# EAGLE schematic H2 V5.3.schh - Copy (EAGLE 9.6.2)

## Sheet 1 of 3
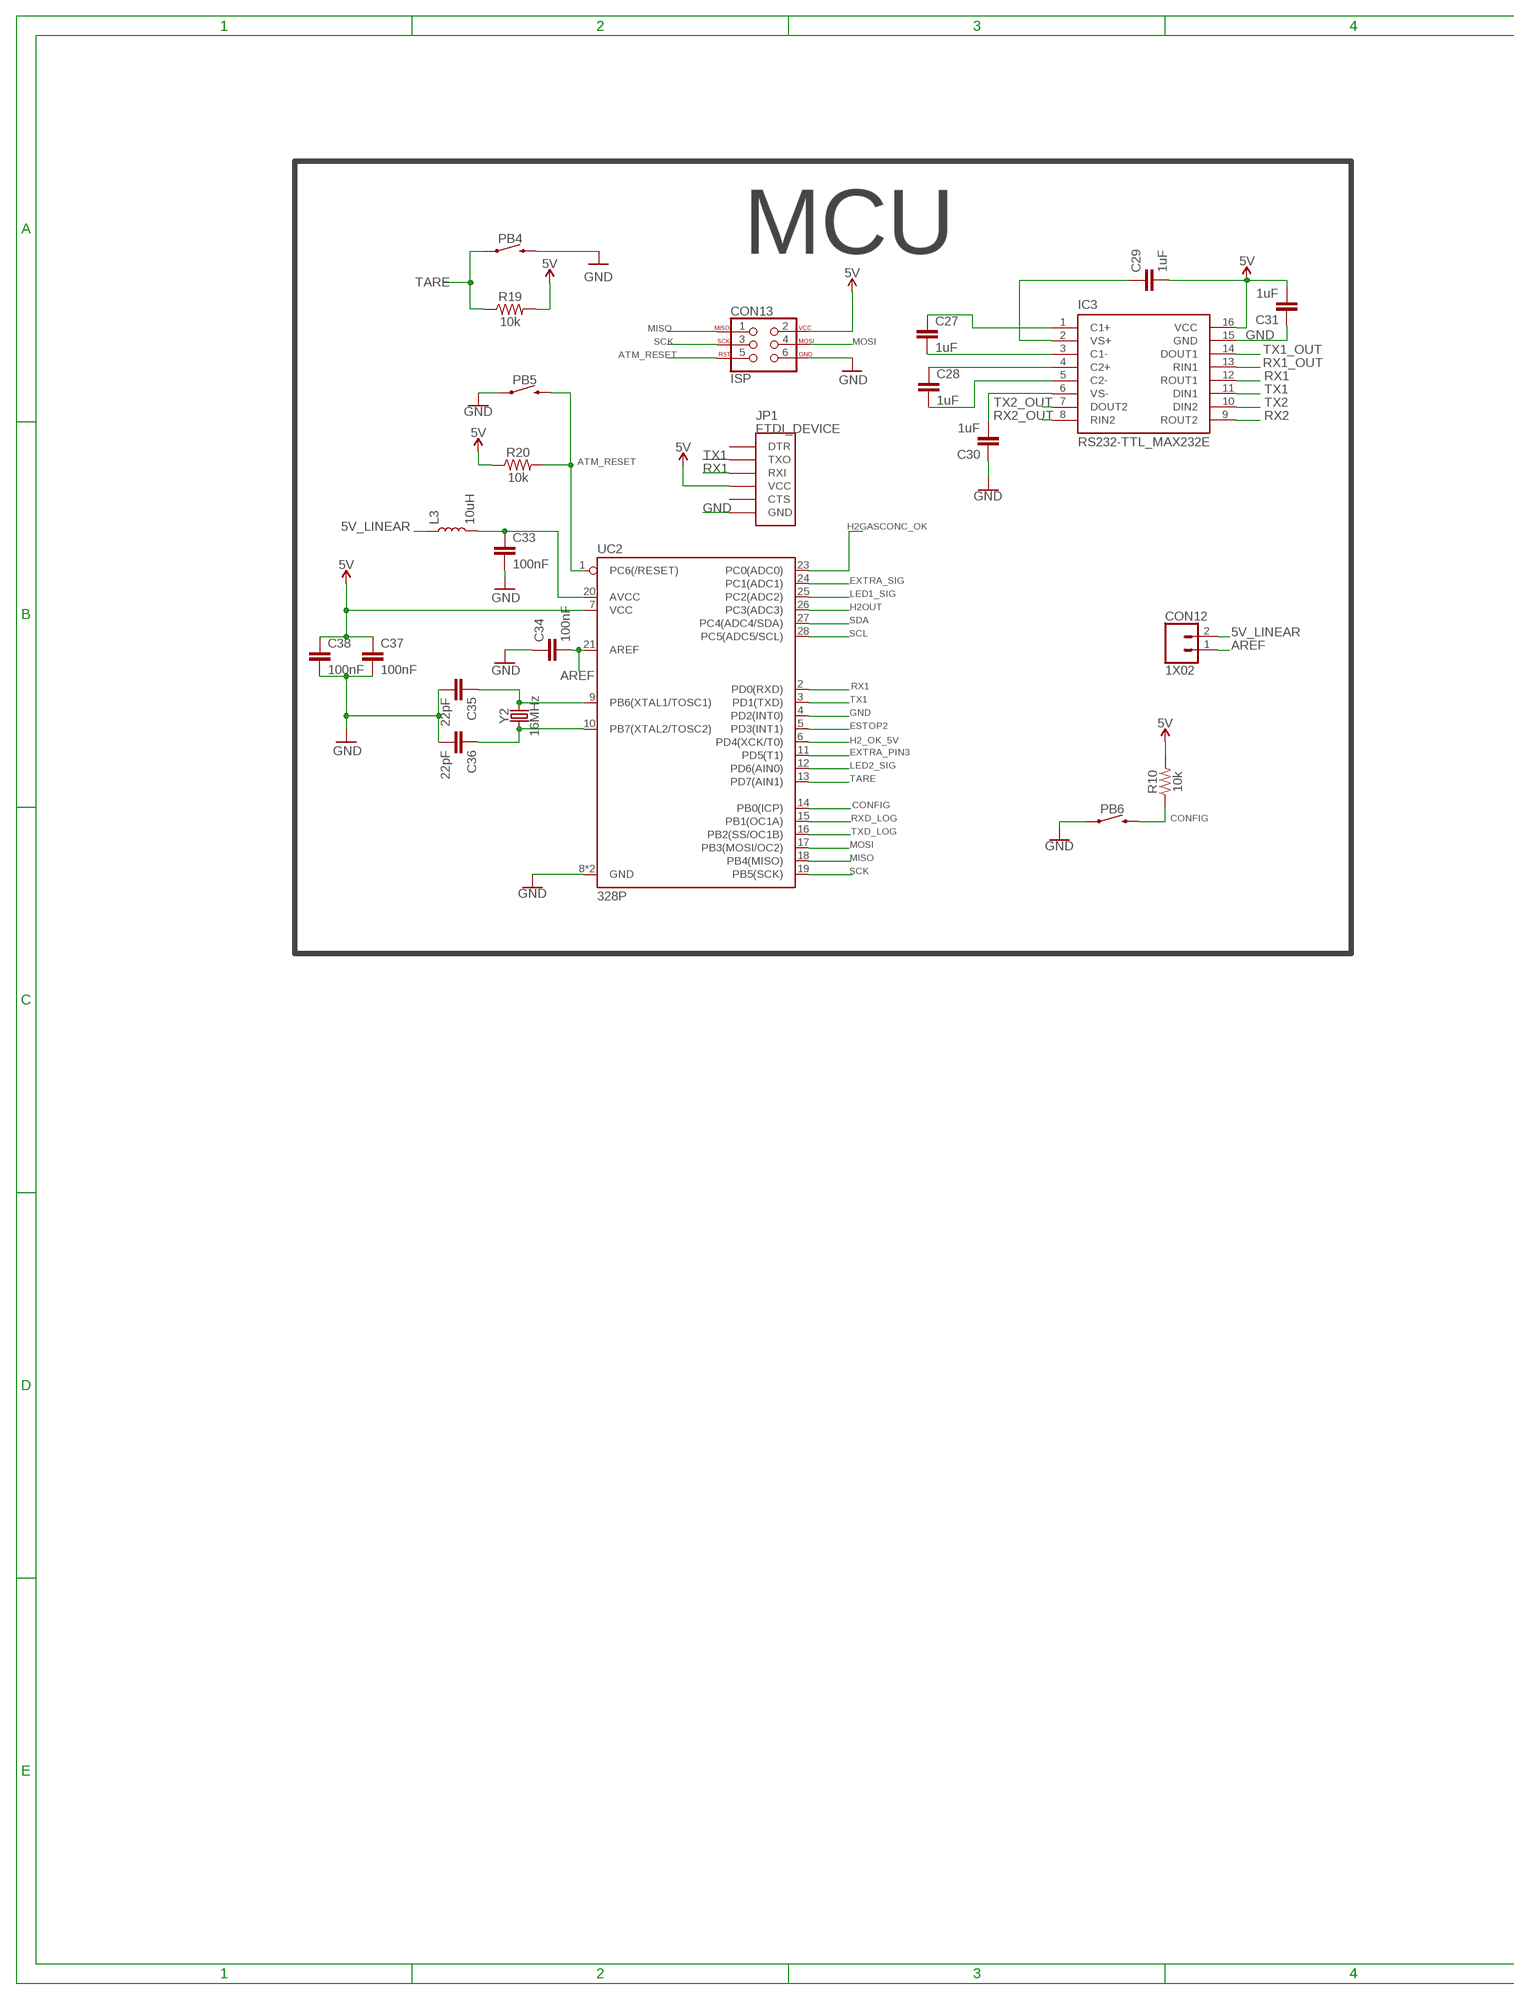
[diagram p0: schematic, sheet 1, part 1 of 2]
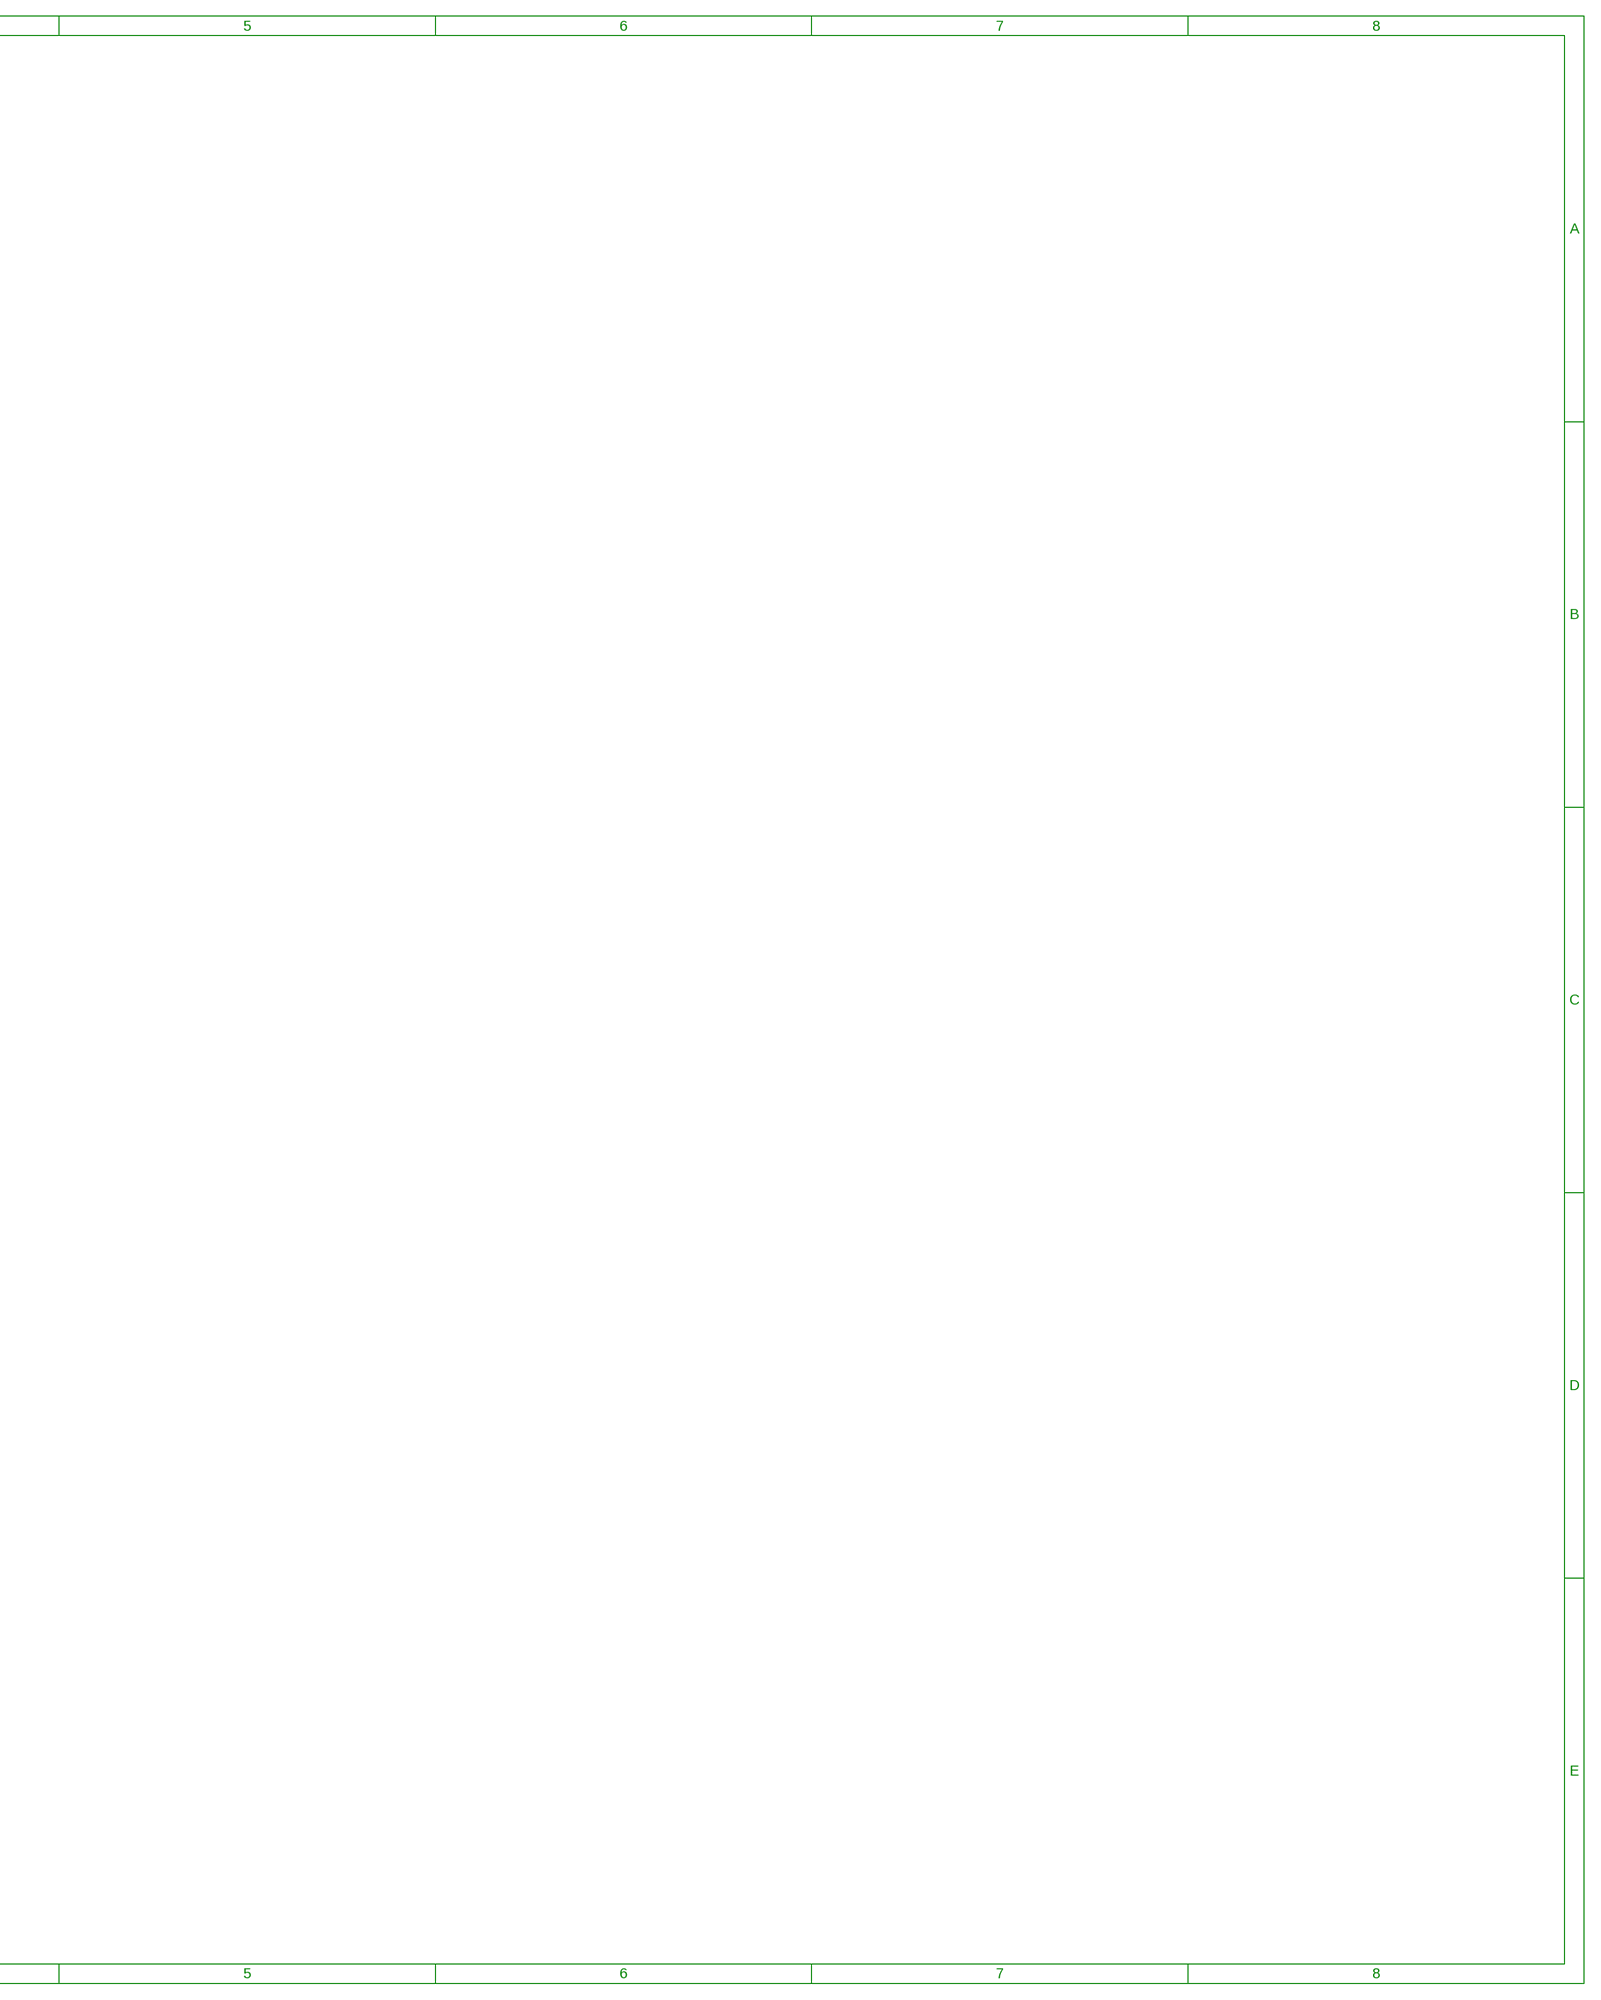
[diagram p1: schematic, sheet 1, part 2 of 2]

### Parts
C27  1uF  CAPACITOR_0805  [0805]
C28  1uF  CAPACITOR_0805  [0805]
C29  1uF  CAPACITOR_0805  [0805]
C30  1uF  CAPACITOR_0805  [0805]
C31  1uF  CAPACITOR_0805  [0805]
C33  100nF  CAPACITOR_0805  [0805]
C34  100nF  CAPACITOR_0805  [0805]
C35  22pF  CAPACITOR_0805  [0805]
C36  22pF  CAPACITOR_0805  [0805]
C37  100nF  CAPACITOR_0805  [0805]
C38  100nF  CAPACITOR_0805  [0805]
CON12  1X02  [1X02]
CON13  ISP  [ISP_CONNECTOR]
IC3  RS232-TTL_MAX232E  [DIP16]
JP1  FTDI_DEVICE  [FTDI_DEVICE_SIDE]
L3  10uH  INDUCTOR_0805  [0805]
PB4  PUSHBUTTON  [PUSHBUTTON]
PB5  PUSHBUTTON  [PUSHBUTTON]
PB6  PUSHBUTTON  [PUSHBUTTON]
R10  10k  RESISTOR_0805  [0805]
R19  10k  RESISTOR_0805  [0805]
R20  10k  RESISTOR_0805  [0805]
UC2  328P  ATMEGA328P_DIP28  [DIP28]
Y2  16MHz  CRYSTAL-16MHZPTH-HC49US  [HC49US]

### Nets
5V: C29.2 C31.2 C37.1 C38.1 CON13.2 IC3.16(VCC) JP1.P$4(VCC) R10.2 R19.2 R20.1 UC2.7(VCC) ; also sheet 2,3
5V_LINEAR: CON12.2 L3.1 ; also sheet 2,3
AREF: C34.2 CON12.1 UC2.21(AREF)
ATM_RESET: CON13.5 PB5.3 PB5.4 R20.2 UC2.1(PC6(/RESET))
CONFIG: PB6.3 PB6.4 R10.1 UC2.14(PB0(ICP))
ESTOP2: UC2.5(PD3(INT1))
EXTRA_PIN3: UC2.11(PD5(T1))
EXTRA_SIG: UC2.24(PC1(ADC1)) ; also sheet 3
GND: C30.1 C31.1 C33.2 C34.1 C35.2 C36.2 C37.2 C38.2 CON13.6 IC3.15(GND) JP1.P$6(GND) PB4.3 PB4.4 PB5.1 PB5.2 PB6.1 PB6.2 UC2.4(PD2(INT0)) UC2.8(GND) UC2.22(GND) ; also sheet 2,3
H2_OK_5V: UC2.6(PD4(XCK/T0)) ; also sheet 3
H2GASCONC_OK: UC2.23(PC0(ADC0)) ; also sheet 3
H2OUT: UC2.26(PC3(ADC3)) ; also sheet 2
LED1_SIG: UC2.25(PC2(ADC2)) ; also sheet 2
LED2_SIG: UC2.12(PD6(AIN0)) ; also sheet 2
MISO: CON13.1 UC2.18(PB4(MISO))
MOSI: CON13.4 UC2.17(PB3(MOSI/OC2))
N$14: C35.1 UC2.9(PB6(XTAL1/TOSC1)) Y2.2
N$17: C36.1 UC2.10(PB7(XTAL2/TOSC2)) Y2.1
N$19: C33.1 L3.2 UC2.20(AVCC)
N$24: C27.2 IC3.3(C1-)
N$26: C27.1 IC3.1(C1+)
N$27: C28.1 IC3.4(C2+)
N$28: C28.2 IC3.5(C2-)
N$29: C30.2 IC3.6(VS-)
N$30: C29.1 IC3.2(VS+)
RX1: IC3.12(ROUT1) JP1.P$3(RXI) UC2.2(PD0(RXD))
RX1_OUT: IC3.13(RIN1) ; also sheet 3
RX2: IC3.9(ROUT2)
RX2_OUT: IC3.8(RIN2)
RXD_LOG: UC2.15(PB1(OC1A)) ; also sheet 2
SCK: CON13.3 UC2.19(PB5(SCK))
SCL: UC2.28(PC5(ADC5/SCL)) ; also sheet 2
SDA: UC2.27(PC4(ADC4/SDA)) ; also sheet 2
TARE: PB4.1 PB4.2 R19.1 UC2.13(PD7(AIN1))
TX1: IC3.11(DIN1) JP1.P$2(TXO) UC2.3(PD1(TXD))
TX1_OUT: IC3.14(DOUT1) ; also sheet 3
TX2: IC3.10(DIN2)
TX2_OUT: IC3.7(DOUT2)
TXD_LOG: UC2.16(PB2(SS/OC1B)) ; also sheet 2
Unconnected: JP1.P$1(DTR) JP1.P$5(CTS)

### Notes on the sheet
- MCU

## Sheet 2 of 3
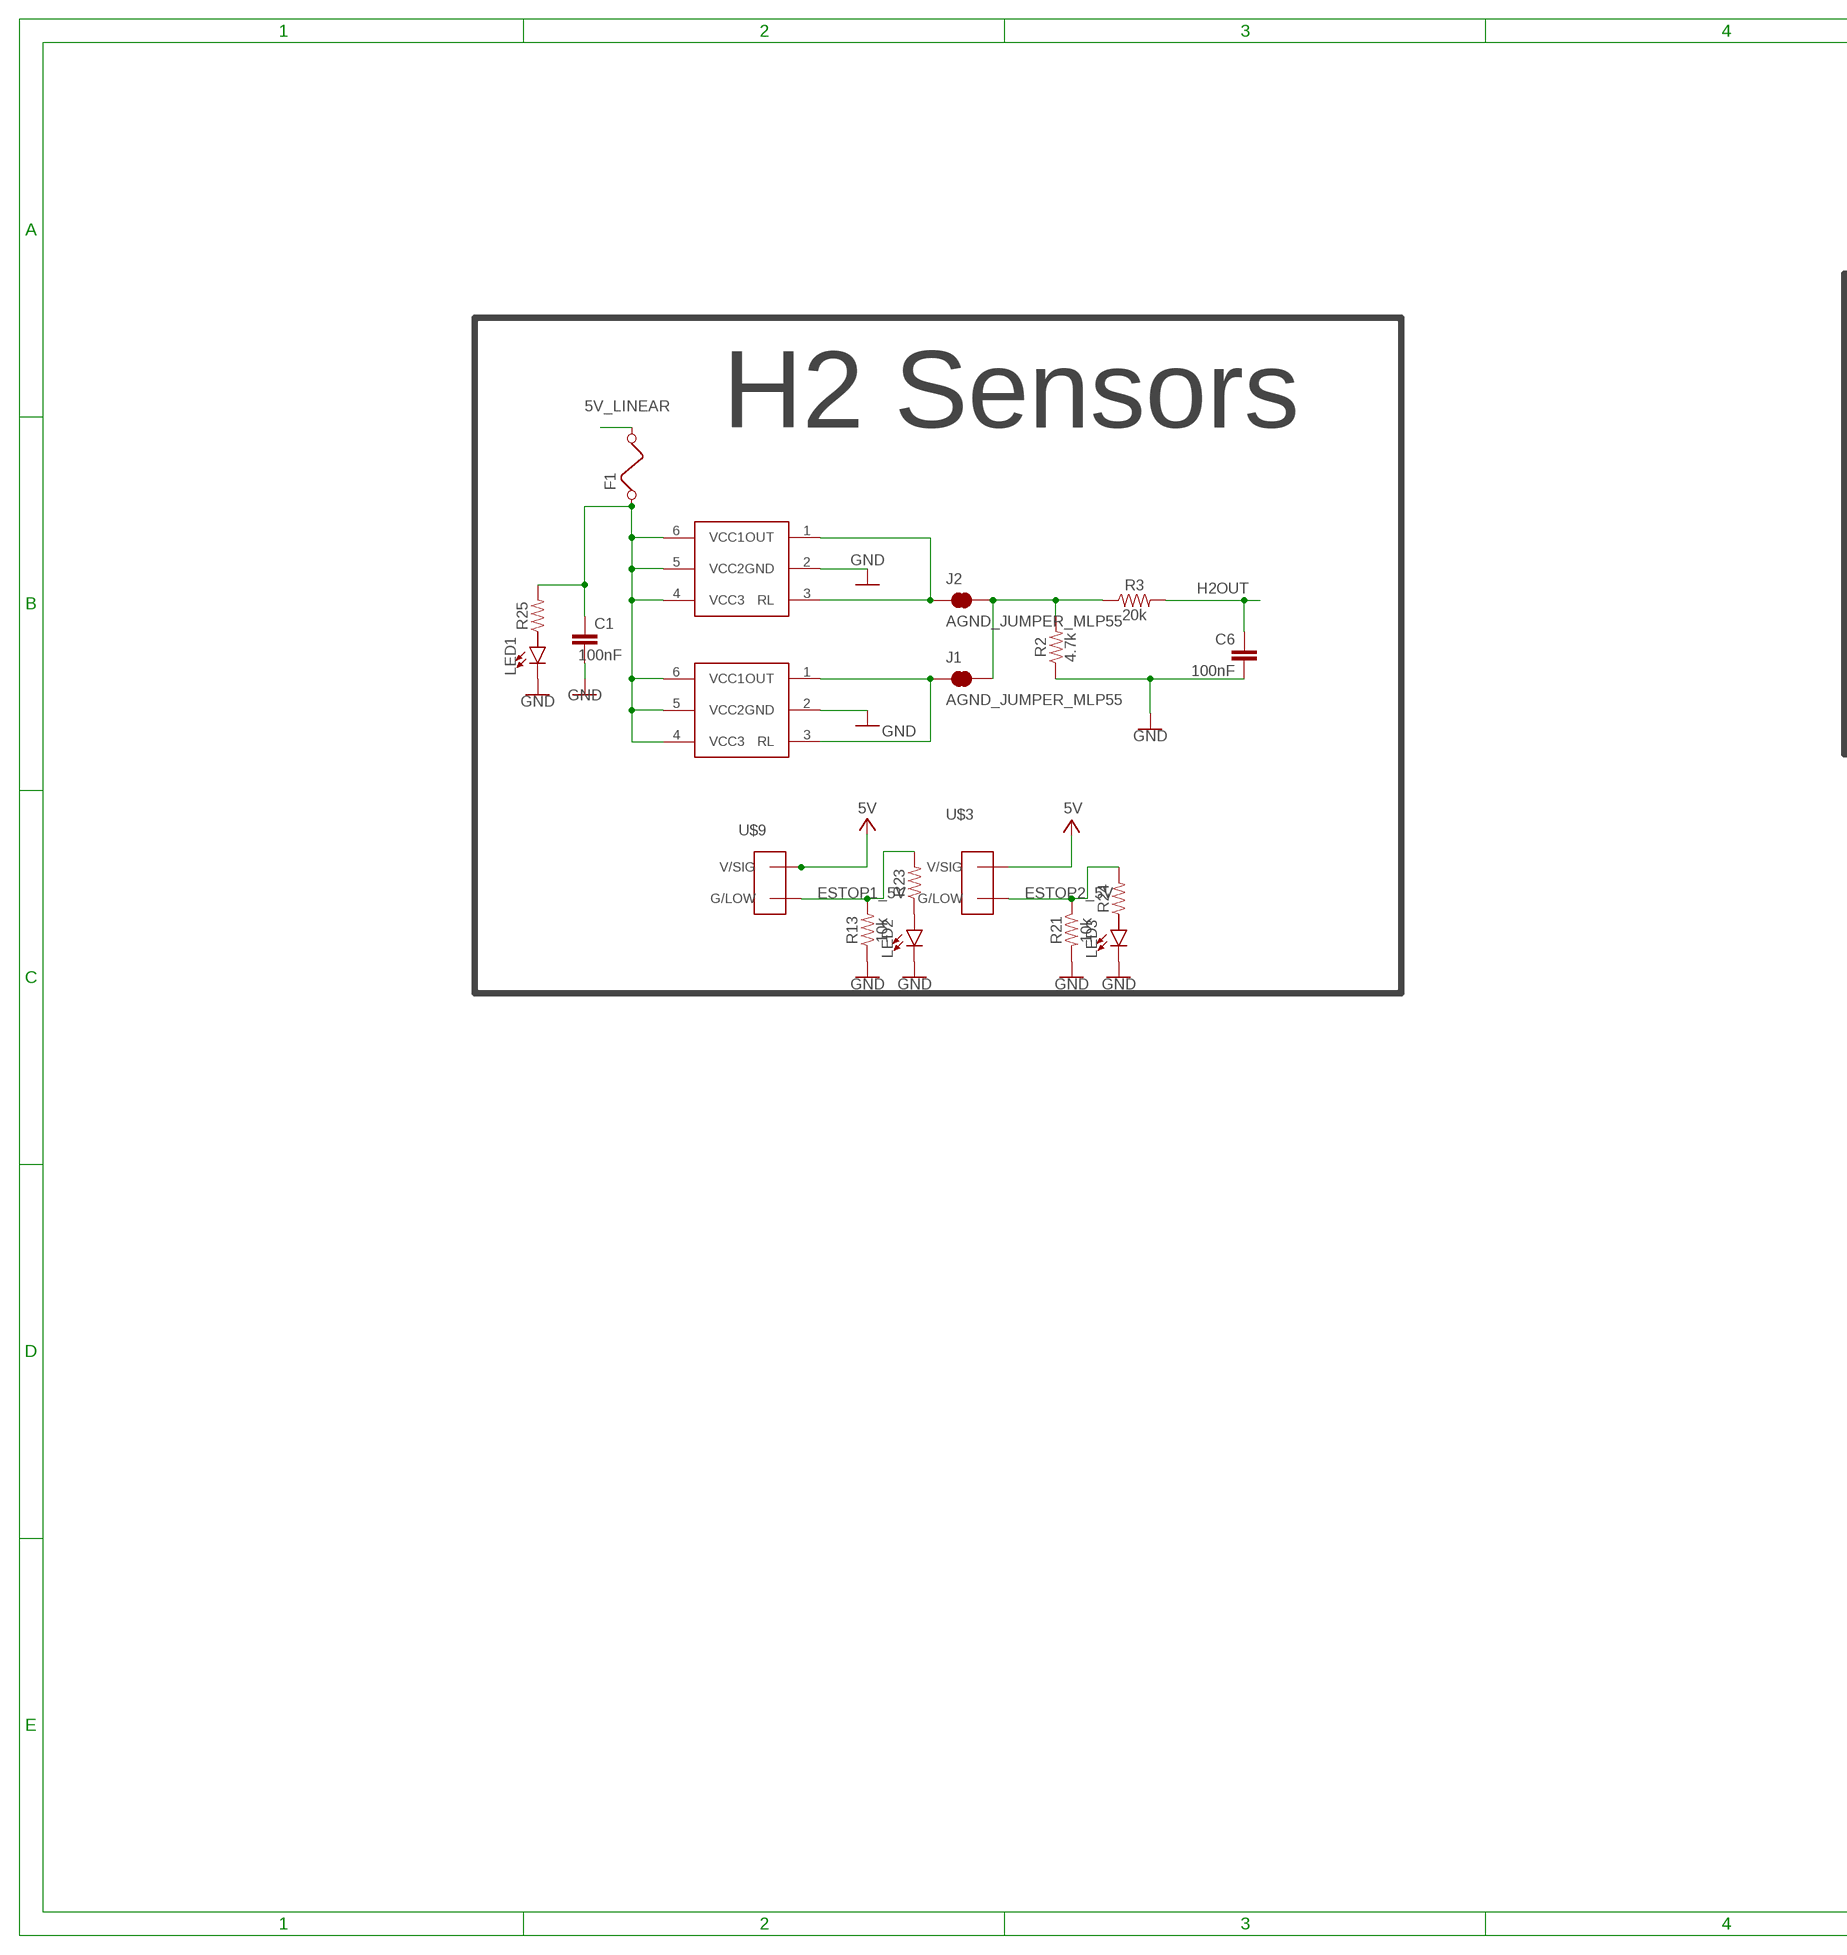
[diagram p2: schematic, sheet 2, part 1 of 2]
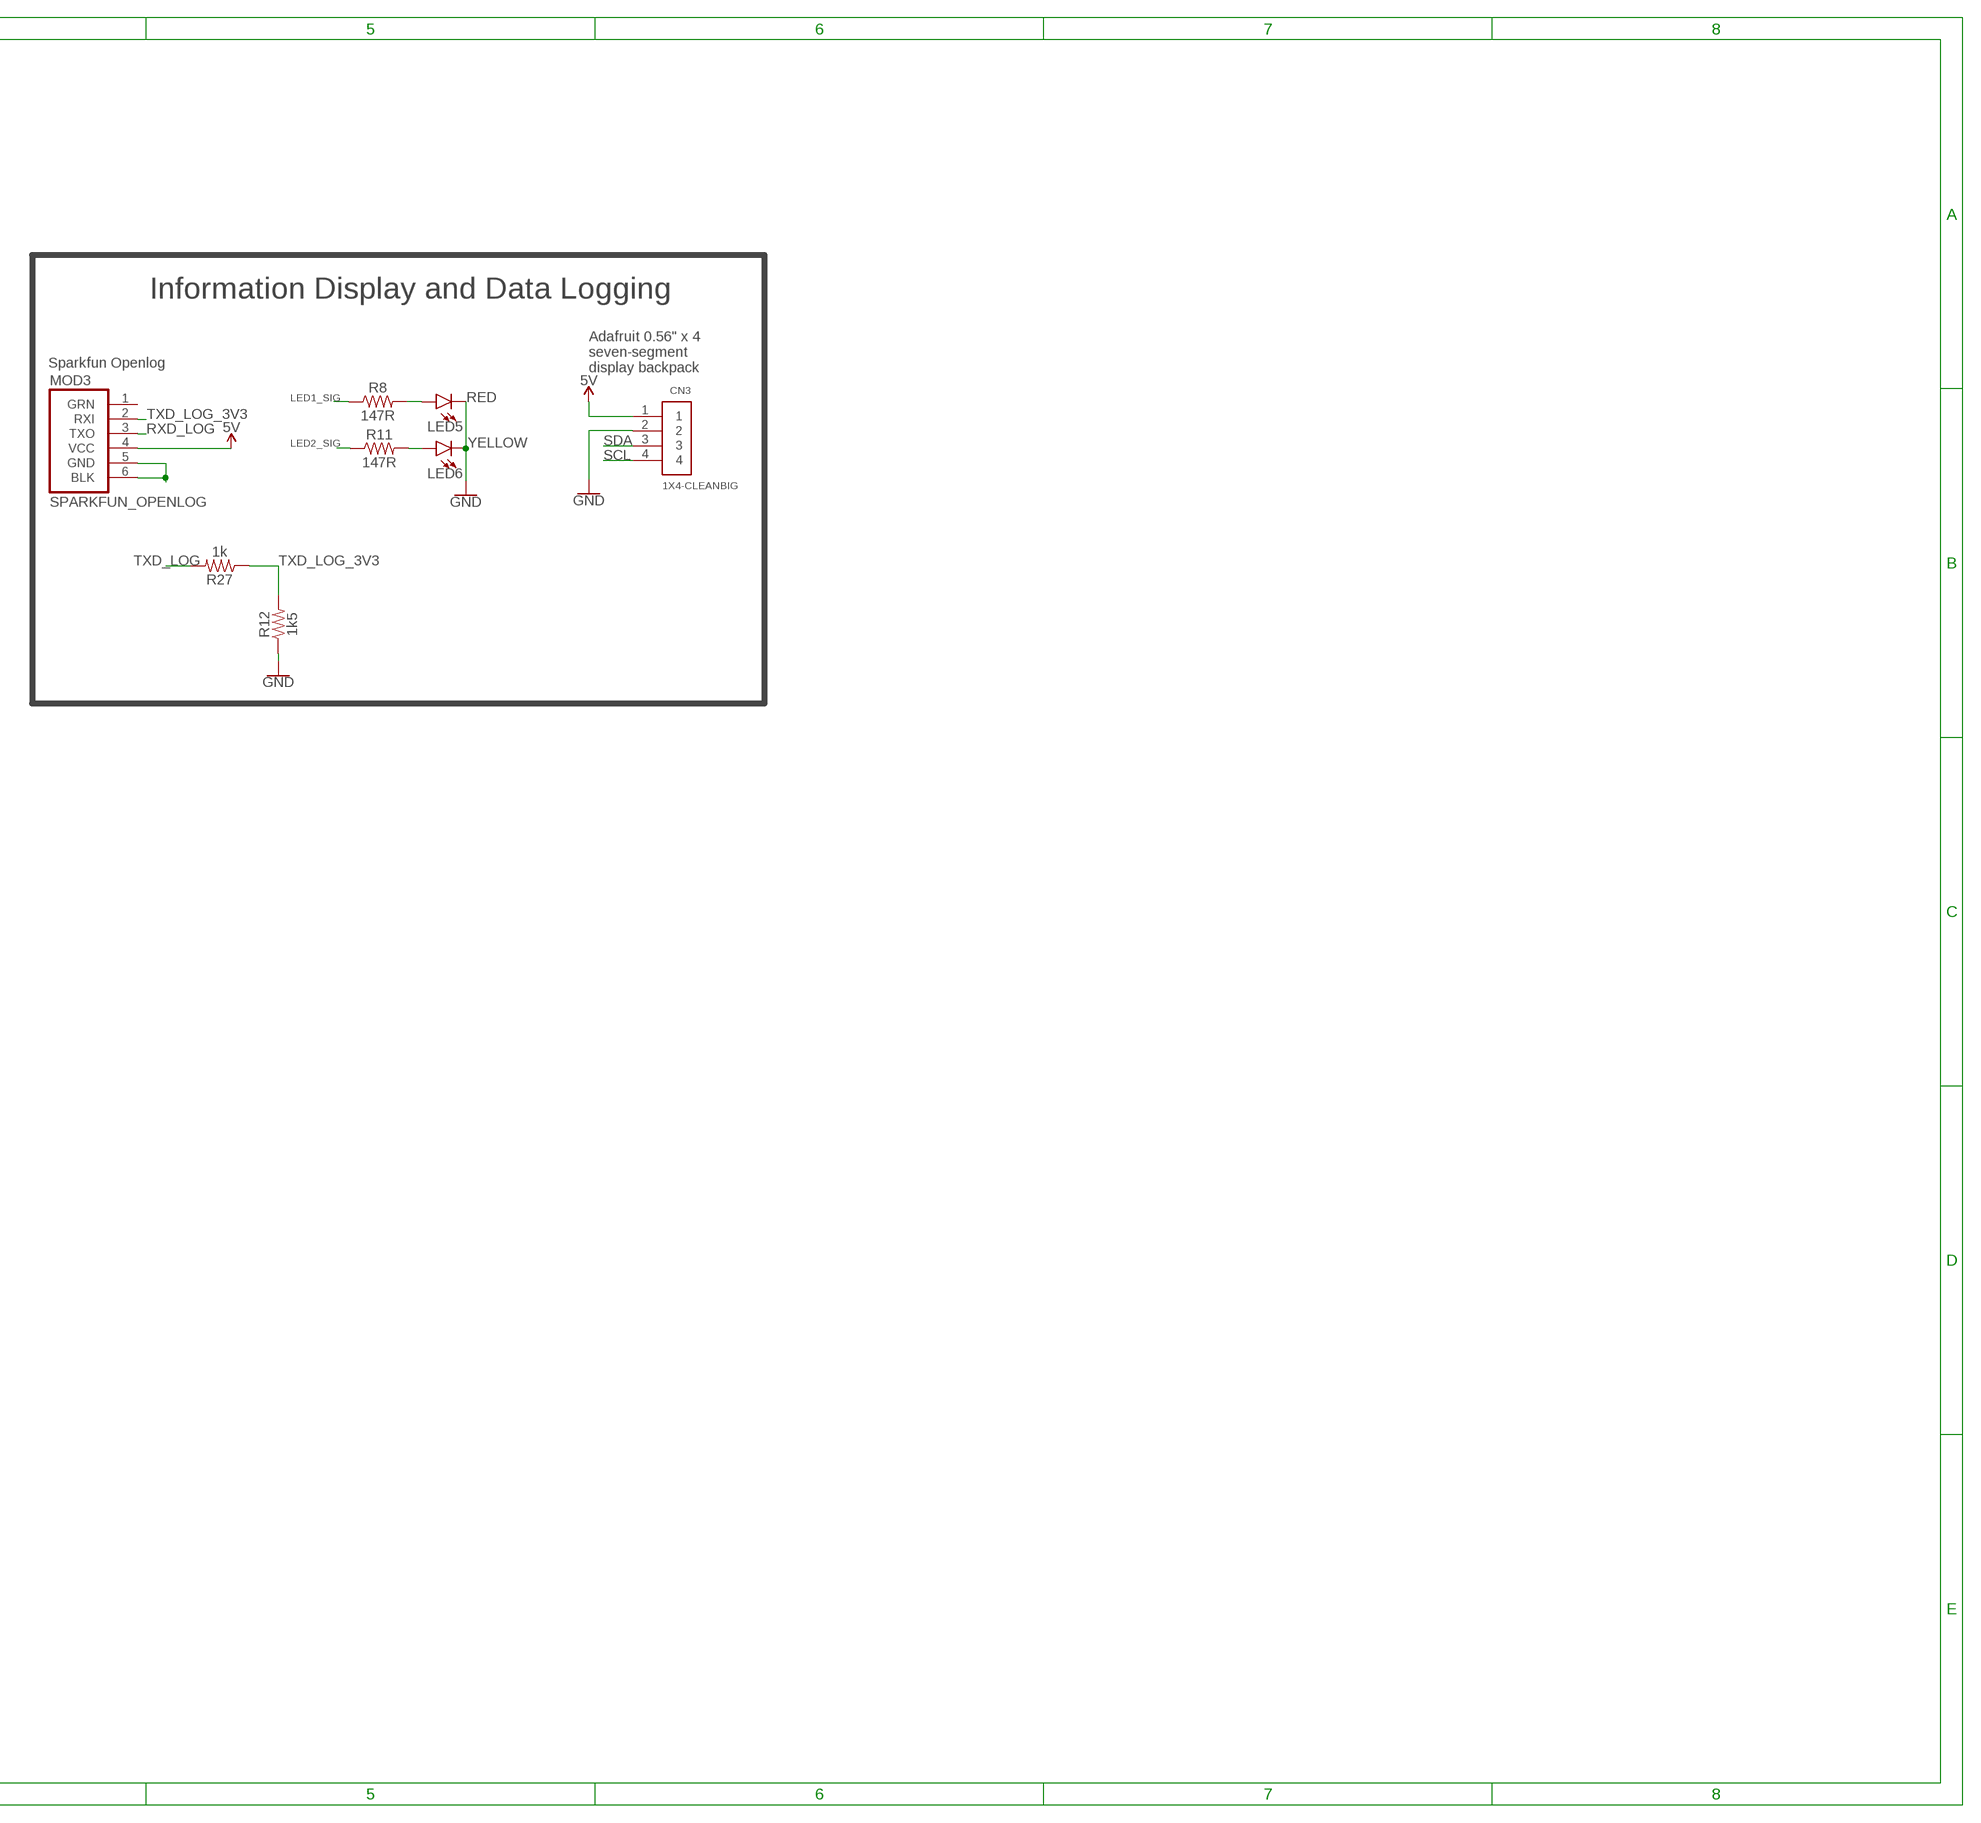
[diagram p3: schematic, sheet 2, part 2 of 2]

### Parts
C1  100nF  CAPACITOR_0805  [0805]
C6  100nF  CAPACITOR_0805  [0805]
CN3  1X4-CLEANBIG  [1X04-CLEANBIG]
F1  FUSE_1210  [1210]
J1  AGND_JUMPER_MLP55  [AGND_JUMPER_MLP55]
J2  AGND_JUMPER_MLP55  [AGND_JUMPER_MLP55]
LED1  LED_0805  [0805_LED]
LED2  LED_0805  [0805_LED]
LED3  LED_0805  [0805_LED]
LED5  RED  LED_0805  [0805_LED]
LED6  YELLOW  LED_0805  [0805_LED]
MOD3  SPARKFUN_OPENLOG  [SPARKFUN_OPENLOG]
R2  4.7k  RESISTOR_0805  [0805]
R3  20k  RESISTOR_0805  [0805]
R8  147R  RESISTOR_0805  [0805]
R11  147R  RESISTOR_0805  [0805]
R12  1k5  RESISTOR_0805  [0805]
R13  10k  RESISTOR_1210  [1210]
R21  10k  RESISTOR_1210  [1210]
R23  RESISTOR_0805  [0805]
R24  RESISTOR_0805  [0805]
R25  RESISTOR_0805  [0805]
R27  1k  RESISTOR_0805  [0805]
U$1  MQ-8MQ-8  [MQ-8]
U$2  MQ-8MQ-8  [MQ-8]
U$3  TE770966  [2X1-MATE-N-LOCK]
U$9  TE770966  [2X1-MATE-N-LOCK]

### Nets
5V: CN3.1 MOD3.4(VCC) U$3.CIRCUIT1(V/SIG) U$9.CIRCUIT1(V/SIG) ; supply symbol labelled +5V ; also sheet 1,3
5V_LINEAR: C1.1 F1.1 F1.2 R25.2 U$1.4(VCC3) U$1.5(VCC2) U$1.6(VCC1) U$2.4(VCC3) U$2.5(VCC2) U$2.6(VCC1) ; also sheet 1,3
ESTOP1_5V: R13.2 R23.2 U$9.CIRCUIT2(G/LOW) ; also sheet 3
ESTOP2_5V: R21.1 R24.2 U$3.CIRCUIT2(G/LOW) ; also sheet 3
GND: C1.2 C6.2 CN3.2 LED1.2(C) LED2.2(C) LED3.2(C) LED5.2(C) LED6.2(C) R2.1 R12.1 R13.1 R21.2 U$1.2(GND) U$2.2(GND) ; also sheet 1,3
H2OUT: C6.1 R3.2 ; also sheet 1
LED1_SIG: R8.1 ; also sheet 1
LED2_SIG: R11.1 ; also sheet 1
N$1: LED5.1(A) R8.2
N$3: J1.P$2 J2.P$2 R2.2 R3.1
N$4: J1.P$1 U$2.1(OUT) U$2.3(RL)
N$6: J2.P$1 U$1.1(OUT) U$1.3(RL)
N$12: LED2.1(A) R23.1
N$15: LED6.1(A) R11.2
N$16: MOD3.5(GND) MOD3.6(BLK)
RXD_LOG: MOD3.3(TXO) ; also sheet 1
SCL: CN3.4 ; also sheet 1
SDA: CN3.3 ; also sheet 1
TXD_LOG: R27.2 ; also sheet 1
TXD_LOG_3V3: MOD3.2(RXI) R12.2 R27.1
Unconnected: LED1.1(A) LED3.1(A) MOD3.1(GRN) R24.1 R25.1

### Notes on the sheet
- Information Display and Data Logging
- Sparkfun Openlog
- Adafruit 0.56" x 4 
  seven-segment 
  display backpack
- H2 Sensors

## Sheet 3 of 3
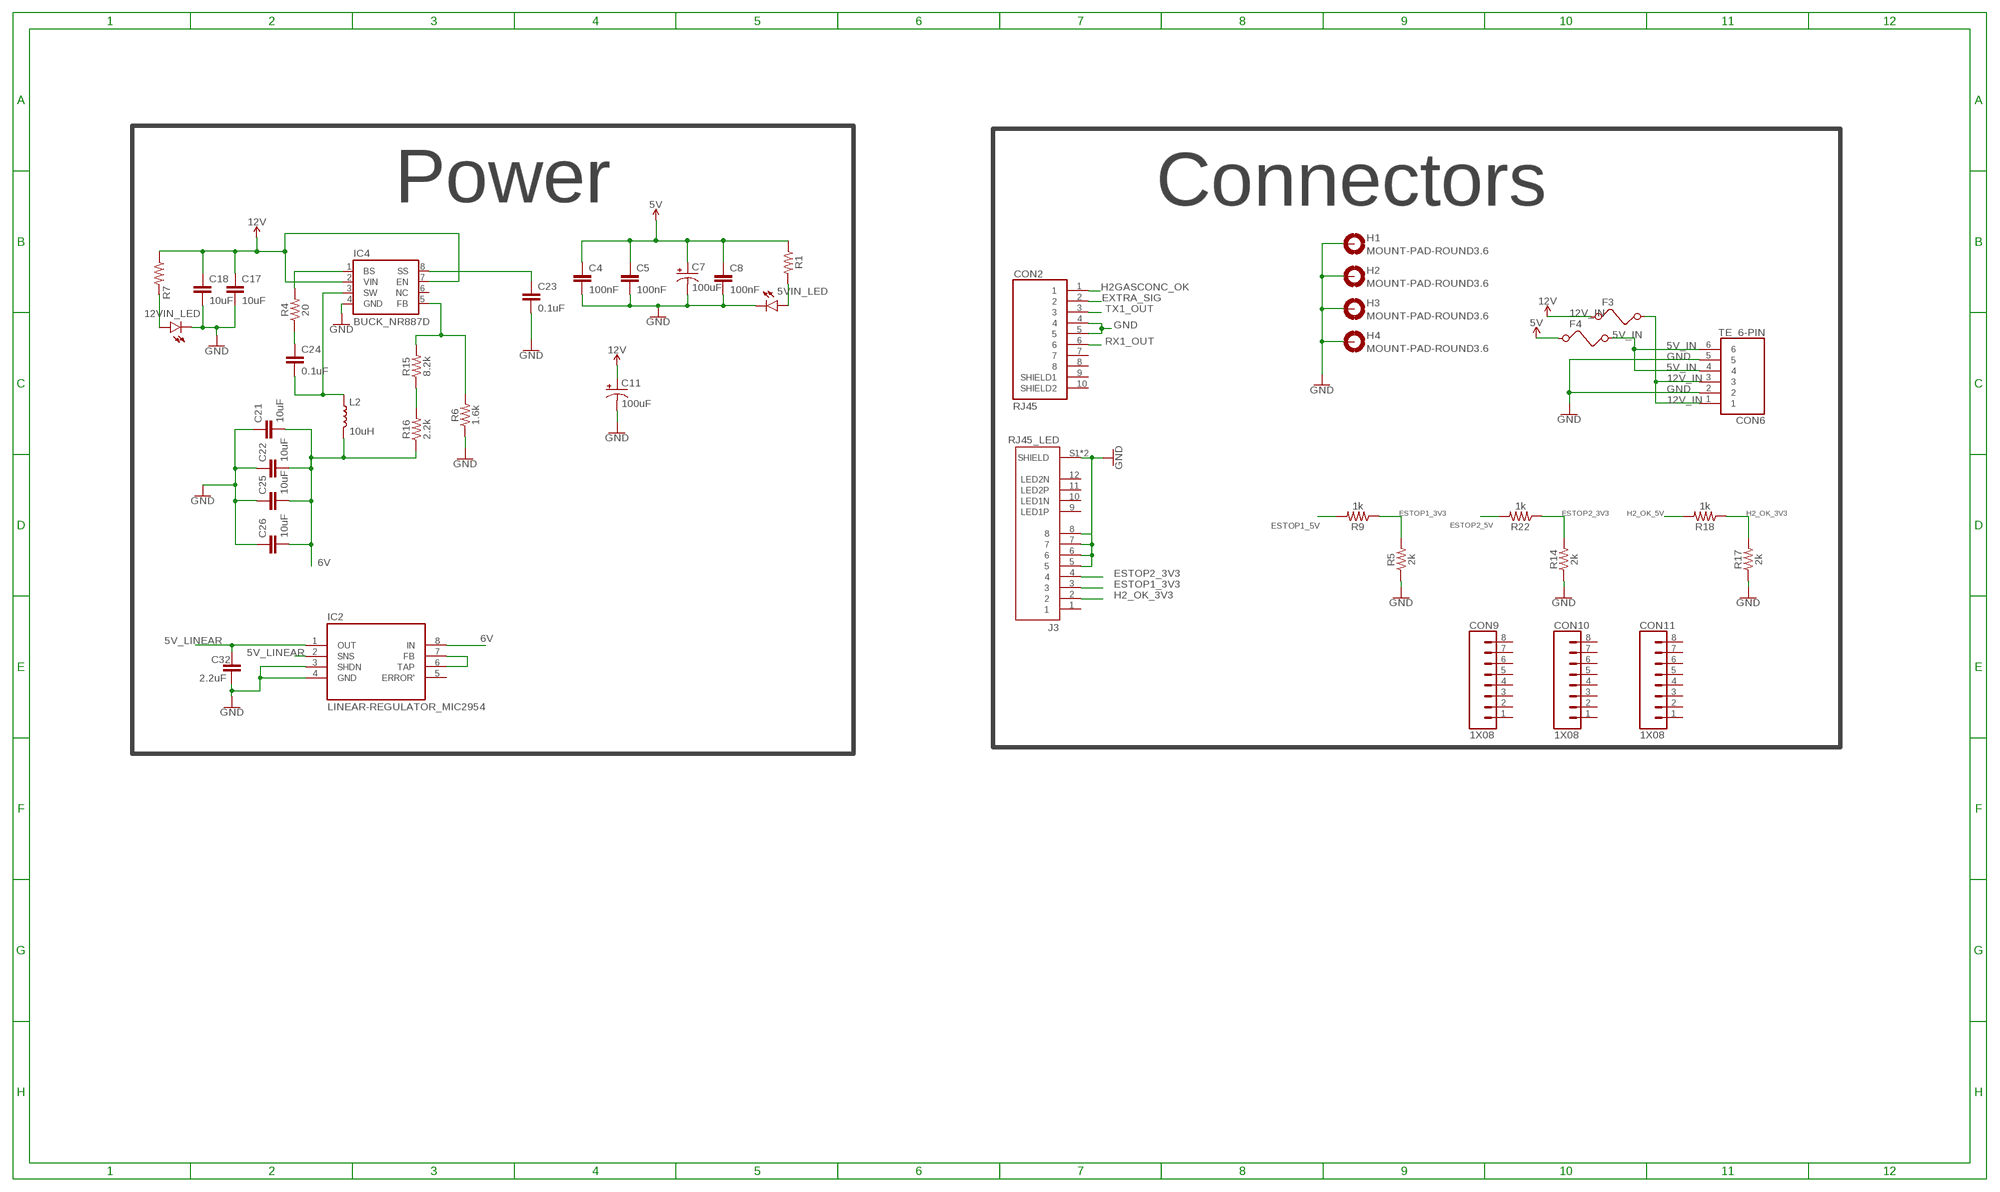
[diagram p4: schematic, sheet 3]

### Parts
5VIN_LED  LED_0805  [0805_LED]
12VIN_LED  LED_0805  [0805_LED]
C4  100nF  CAPACITOR_0805  [0805]
C5  100nF  CAPACITOR_0805  [0805]
C7  100uF  CAPACITOR_ELECTROLYTIC_100UF  [CAPACITOR_100UF_50V]
C8  100nF  CAPACITOR_0805  [0805]
C11  100uF  CAPACITOR_ELECTROLYTIC_100UF  [CAPACITOR_100UF_50V]
C17  10uF  CAPACITOR_0805  [0805]
C18  10uF  CAPACITOR_0805  [0805]
C21  10uF  CAPACITOR_1210  [1210]
C22  10uF  CAPACITOR_1210  [1210]
C23  0.1uF  CAPACITOR_0805  [0805]
C24  0.1uF  CAPACITOR_0805  [0805]
C25  10uF  CAPACITOR_1210  [1210]
C26  10uF  CAPACITOR_1210  [1210]
C32  2.2uF  CAPACITOR_0805  [0805]
CON2  RJ45  [RJ45]
CON6  TE_6-PIN  [TE_6-PIN]
CON9  1X08  [1X08]
CON10  1X08  [1X08]
CON11  1X08  [1X08]
F3  FUSE_1210  [1210]
F4  FUSE_1210  [1210]
H1  MOUNT-PAD-ROUND3.6  [3,6-PAD]
H2  MOUNT-PAD-ROUND3.6  [3,6-PAD]
H3  MOUNT-PAD-ROUND3.6  [3,6-PAD]
H4  MOUNT-PAD-ROUND3.6  [3,6-PAD]
IC2  LINEAR-REGULATOR_MIC2954  [SOIC8]
IC4  BUCK_NR887D  [DIP08]
J3  RJ45_LED  [RJ45_LED]
L2  10uH  INDUCTOR_MURATA_DEM8030C  [INDUCTOR_MURATA_DEM8030C]
R1  RESISTOR_0805  [0805]
R4  20  RESISTOR_0805  [0805]
R5  2k  RESISTOR_0805  [0805]
R6  1.6k  RESISTOR_0805  [0805]
R7  RESISTOR_0805  [0805]
R9  1k  RESISTOR_0805  [0805]
R14  2k  RESISTOR_0805  [0805]
R15  8.2k  RESISTOR_0805  [0805]
R16  2.2k  RESISTOR_0805  [0805]
R17  2k  RESISTOR_0805  [0805]
R18  1k  RESISTOR_0805  [0805]
R22  1k  RESISTOR_0805  [0805]

### Nets
5V: C4.1 C5.1 C8.1 F4.1 R1.1 ; also sheet 1,2
5V_IN: CON6.4 CON6.6 F4.2
5V_LINEAR: C32.1 IC2.1(OUT) IC2.2(SNS) ; also sheet 1,2
6V: C21.2 C22.2 C25.2 C26.2 IC2.8(IN) L2.P$2 R16.1
12V: C11.+ C17.1 C18.1 F3.1 IC4.2(VIN) IC4.7(EN) R7.1
12V_IN: CON6.1 CON6.3 F3.2
ESTOP1_3V3: J3.3 R5.2 R9.1
ESTOP1_5V: R9.2 ; also sheet 2
ESTOP2_3V3: J3.4 R14.2 R22.1
ESTOP2_5V: R22.2 ; also sheet 2
EXTRA_SIG: CON2.2 ; also sheet 1
GND: 5VIN_LED.2(C) 12VIN_LED.2(C) C4.2 C5.2 C7.- C8.2 C11.- C17.2 C18.2 C21.1 C22.1 C23.2 C25.1 C26.1 C32.2 CON2.4 CON2.5 CON6.2 CON6.5 H1.B3,6(MOUNT) H2.B3,6(MOUNT) H3.B3,6(MOUNT) H4.B3,6(MOUNT) IC2.3(SHDN) IC2.4(GND) IC4.4(GND) J3.5 J3.6 J3.7 J3.8 J3.S1(SHIELD) J3.S2(SHIELD) R5.1 R6.1 R14.1 R17.1 ; also sheet 1,2
H2_OK_3V3: J3.2 R17.2 R18.1
H2_OK_5V: R18.2 ; also sheet 1
H2GASCONC_OK: CON2.1 ; also sheet 1
N$2: C23.1 IC4.8(SS)
N$5: IC4.1(BS) R4.2
N$8: C24.1 R4.1
N$9: C24.2 IC4.3(SW) L2.P$1
N$10: IC4.5(FB) R6.2 R15.2
N$11: IC2.6(TAP) IC2.7(FB)
N$13: R15.1 R16.2
N$18: C7.+
N$20: 12VIN_LED.1(A) R7.2
N$22: 5VIN_LED.1(A) R1.2
RX1_OUT: CON2.6 ; also sheet 1
TX1_OUT: CON2.3 ; also sheet 1
Unconnected: CON2.7 CON2.8 CON2.9(SHIELD1) CON2.10(SHIELD2) CON9.1 CON9.2 CON9.3 CON9.4 CON9.5 CON9.6 CON9.7 CON9.8 CON10.1 CON10.2 CON10.3 CON10.4 CON10.5 CON10.6 CON10.7 CON10.8 CON11.1 CON11.2 CON11.3 CON11.4 CON11.5 CON11.6 CON11.7 CON11.8 IC2.5(ERROR') IC4.6(NC) J3.1 J3.9(LED1P) J3.10(LED1N) J3.11(LED2P) J3.12(LED2N)

### Notes on the sheet
- Power | Connectors

## Library data of the parts
5VIN_LED LED1-LED3 LED5 LED6 = EcoCar-Discrete-Semiconductors:LED_0805
12VIN_LED = EcoCar-Discrete-Semiconductors:LED_0805; SPICEPREFIX: B
C1 C4-C6 C8 C17 C18 C23 C24 C27-C38 = EcoCar-Passives:CAPACITOR_0805
C7 C11 = EcoCar-Passives:CAPACITOR_ELECTROLYTIC_100UF: 50V 100uF Electrolytic Capacitor Manufacturer: Nichicon Series: UVZ Part Number: UVZ1H101MPD1TD Digikey Part Number: 493-13464-1-ND
C21 C22 C25 C26 = EcoCar-Passives:CAPACITOR_1210
CN3 = adafruit:1X4: 4-pin connector
CON2 = EcoCar-Connectors:RJ45: RJ45 Connector - Use for signals and low power connections Unshielded Part Number: RJHSE-5080 Unshielded Digikey Part Number: RJHSE-5080-ND Shielded Part Number: RJHSE5E80 Shielded Digikey Part Number: RJHSE5E80-ND
CON6 = EcoCar-Connectors:TE_6-PIN: 6 Pin TE Mini-Universal MATE-N-LOK Part Number: 1-770969-0 Digikey Part Number: A32475-ND Matching Plug: A97674-ND Matching Crimps: A100828CT-ND
CON9-CON11 = EcoCar-Connectors-2.54mm:1X08: 2.54mm (0.1") Header
CON12 = EcoCar-Connectors-2.54mm:1X02: 2.54mm (0.1") Header
CON13 = EcoCar-Microcontrollers:ISP: ISP Header Use for programming microcontrollers such as the 328P
F1 F3 F4 = EcoCar-Fuses-Protection:FUSE_1210: 1210 Surface Mount Fuse
H1-H4 = holes:MOUNT-PAD-ROUND: MOUNTING PAD, round
IC2 = EcoCar-Integrated-Circuits:LINEAR-REGULATOR_MIC2954: 5V/Adjustable 250mA Low-Dropout Linear Regulator Manufacturer: Microchip Part Number: MIC2954-08YM-TR Digikey Part Number: 576-1156-1-ND
IC3 = EcoCar-Integrated-Circuits:RS232-TTL_MAX232E: Dual 5V TTL to RS-232 Converter Manufacturer: Texas Instruments Part Number: MAX232EIN Digikey Part Number: 296-27963-5-ND
IC4 = EcoCar-Integrated-Circuits:BUCK_NR887D: Sanken 2A Buck Converter Manufacturer: Sanken Part Number: NR887D Digikey Part Number: NR887D-ND
J1 J2 = EcoCar-Miscellaneous:AGND_JUMPER_MLP55
J3 = EcoCar-Connectors:RJ45_LED: RJ45 Connector - Use for signals and low power connections Shielded with LEDs Part Number: 6116173-1 Shielded with LEDs Digikey Part Number: A122645-ND Check availability <https://pricing.snapeda.com/parts/6116173-4/TE%20Connectivity/view-part?ref=eda>; AVAILABILITY: In Stock; COMMENT: 6116173-4; DESCRIPTION: Conn Telephone/Telecom F 8 POS 2.54mm Solder RA Thru-Hole 12 Terminal 1 Port Tray Cat 5; EU_ROHS_COMPLIANCE: Compliant; MF: TE Connectivity; MP: 6116173-4; PACKAGE: None; PRICE: None; PURCHASE-URL: https://pricing.snapeda.com/search/part/6116173-4/?ref=eda
JP1 = SparkFun-Connectors:FTDI_DEVICE: Connector which mates to FTDI basic or FTDI cable.
L2 = EcoCar-Passives:INDUCTOR_MURATA_DEM8030C: Murata DEM8030C Series Inductor Manufacturer: Murata Series: DEM8030C Example Part: 10uH 3.1A Part Number: 1273AS-H-100M=P3 Digikey Part Number: 490-10837-1-ND
L3 = EcoCar-Passives:INDUCTOR_0805
MOD3 = EcoCar-Modules:SPARKFUN_OPENLOG: Sparkfun Openlog Manufacturer: Sparkfun Part Number: DEV-13712 Digikey Part Number: 1568-1368-ND
PB4-PB6 = EcoCar-Electromechanical:PUSHBUTTON: Pushbutton Manufacturer: TE Connectivity ALCOSWITCH Switches Part Number: 1825910-6 Digikey Part Number: 450-1650-ND
R1-R12 R14-R20 R22-R25 R27 = EcoCar-Passives:RESISTOR_0805
R13 R21 = EcoCar-Passives:RESISTOR_1210
U$1 U$2 = donny_library:MQ-8
U$3 U$9 = Shell2013:TE770966
UC2 = EcoCar-Microcontrollers:ATMEGA328P_DIP28: ATmega328P Manufacturer: Microchip Part Number: ATMEGA328P-PU Digikey Part Number: ATMEGA328P-PU-ND; PROD_ID: IC-09136
Y2 = EcoCar-Microcontrollers:CRYSTAL-16MHZ: 16MHz Crystal Oscillator Manufacturer: TXC Part Number: 9B-16.000MBBK-B Digikey Part Number: 887-2015-ND; PROD_ID: XTAL-08181; SF_ID: COM-00536